# Altium schematic sheet GrandMini_v1.SchDoc
size A3; DocumentNumber: 1; SheetNumber: 1
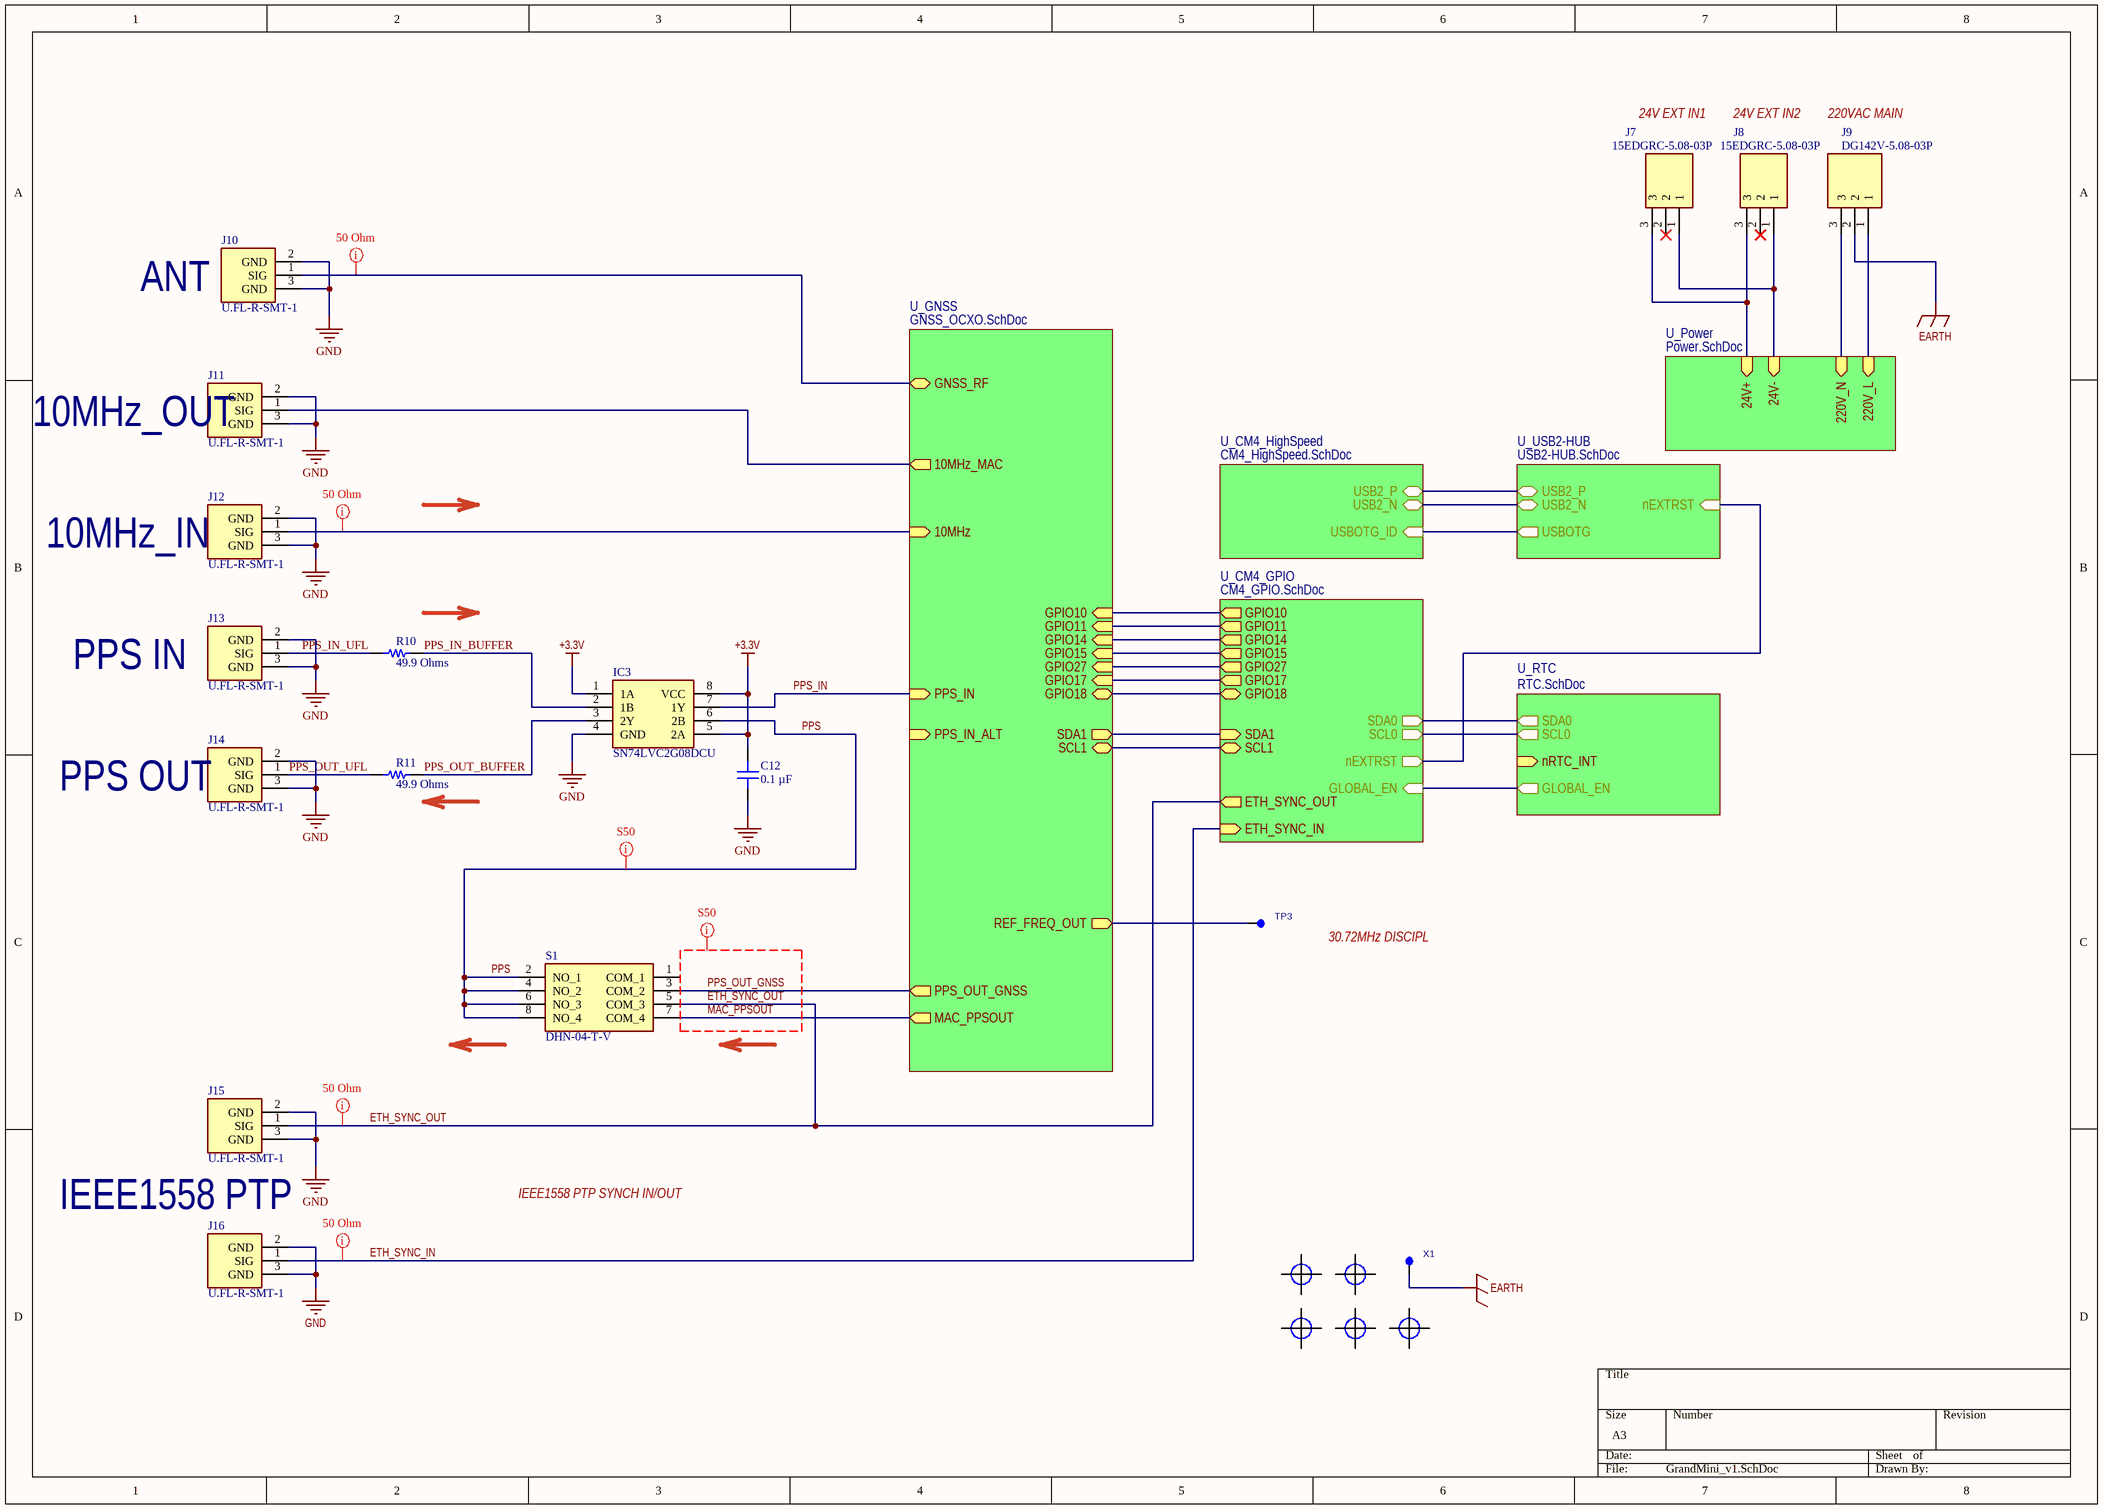
[diagram p0: GrandMini_v1.SchDoc]

## Parts
C12  0.1 µF  [CAP 0603_1608]
IC3  SN74LVC2G08DCU  [SOP50P310X90-8N]
J7  15EDGRC-5.08-03P  [15EDGRC-5.08-03P]
J8  15EDGRC-5.08-03P  [15EDGRC-5.08-03P]
J9  DG142V-5.08-03P  [DG142V-5.08-03P]
J10  U.FL-R-SMT-1  [U.FL-R-SMT-1]
J11  U.FL-R-SMT-1  [U.FL-R-SMT-1]
J12  U.FL-R-SMT-1  [U.FL-R-SMT-1]
J13  U.FL-R-SMT-1  [U.FL-R-SMT-1]
J14  U.FL-R-SMT-1  [U.FL-R-SMT-1]
J15  U.FL-R-SMT-1  [U.FL-R-SMT-1]
J16  U.FL-R-SMT-1  [U.FL-R-SMT-1]
MNT1  MOUNT_HOLE  [MOUNT_3.5mm]  (value not drawn)  (no BOM)
MNT2  MOUNT_HOLE  [MOUNT_3.5mm]  (value not drawn)  (no BOM)
MNT4  MOUNT_HOLE  [MOUNT_3.5mm]  (value not drawn)  (no BOM)
MNT5  MOUNT_HOLE  [MOUNT_3.5mm]  (value not drawn)  (no BOM)
MNT6  MOUNT_HOLE  [MOUNT_3.5mm]  (value not drawn)  (no BOM)
R10  49.9 Ohms  [YAGEO RES 0603_1608]
R11  49.9 Ohms  [YAGEO RES 0603_1608]
S1  DHN-04-T-V  [DHN04TV]
TP3  30.72MHz  [PAD_TEST]  (value not drawn)  (no BOM)
X1  PAD  [POWERPAD_ROU_7/3.2]  (value not drawn)  (no BOM)

## Sub-sheets
U_CM4_GPIO = CM4_GPIO.SchDoc: GLOBAL_EN (in), SCL0 (out), SDA0 (out), nEXTRST (out), SDA1 (in), SCL1 (bidir), ETH_SYNC_IN (in), ETH_SYNC_OUT (out), GPIO10 (out), GPIO11 (out), GPIO14 (out), GPIO15 (out), GPIO27 (out), GPIO17 (out), GPIO18 (bidir)
U_CM4_HighSpeed = CM4_HighSpeed.SchDoc: USBOTG_ID (in), USB2_P (bidir), USB2_N (bidir)
U_GNSS = GNSS_OCXO.SchDoc: 10MHz (in), GNSS_RF (bidir), PPS_IN_ALT (in), PPS_IN (in), GPIO17 (in), GPIO27 (in), GPIO11 (in), GPIO10 (in), REF_FREQ_OUT (out), PPS_OUT_GNSS (out), MAC_PPSOUT (out), GPIO15 (in), GPIO14 (in), GPIO18 (bidir), SDA1 (out), SCL1 (bidir), 10MHz_MAC (out)
U_Power = Power.SchDoc: 220V_L (in), 220V_N (in), 24V+ (in), 24V- (in)
U_RTC = RTC.SchDoc: SCL0 (out), SDA0 (out), GLOBAL_EN (out), nRTC_INT (in)
U_USB2-HUB = USB2-HUB.SchDoc: USB2_N (bidir), USBOTG (out), USB2_P (bidir), nEXTRST (in)

## Nets
+3.3V: C12.2 IC3.1(1A) IC3.5(2A) IC3.8(VCC)
EARTH: J9.2 X1.1
GND: C12.1 IC3.4(GND) J10.2(GND) J10.3(GND) J11.2(GND) J11.3(GND) J12.2(GND) J12.3(GND) J13.2(GND) J13.3(GND) J14.2(GND) J14.3(GND) J15.2(GND) J15.3(GND) J16.2(GND) J16.3(GND)
ETH_SYNC_IN: J16.1(SIG) ; sheet U_CM4_GPIO/ETH_SYNC_IN
ETH_SYNC_OUT: J15.1(SIG) S1.5(COM_3) ; sheet U_CM4_GPIO/ETH_SYNC_OUT
MAC_PPSOUT: S1.7(COM_4) ; sheet U_GNSS/MAC_PPSOUT
PPS: IC3.6(2B) S1.2(NO_1) S1.4(NO_2) S1.6(NO_3) S1.8(NO_4)
PPS_IN: IC3.7(1Y) ; sheet U_GNSS/PPS_IN
PPS_IN_BUFFER: IC3.2(1B) R10.2
PPS_IN_UFL: J13.1(SIG) R10.1
PPS_OUT_BUFFER: IC3.3(2Y) R11.2
PPS_OUT_GNSS: S1.3(COM_2) ; sheet U_GNSS/PPS_OUT_GNSS
PPS_OUT_UFL: J14.1(SIG) R11.1
NetJ7_1: J7.1 J8.1 ; sheet U_Power/24V-
NetJ7_3: J7.3 J8.3 ; sheet U_Power/24V+
NetJ9_1: J9.1 ; sheet U_Power/220V_L
NetJ9_3: J9.3 ; sheet U_Power/220V_N
NetJ10_1: J10.1(SIG) ; sheet U_GNSS/GNSS_RF
NetJ11_1: J11.1(SIG) ; sheet U_GNSS/10MHz_MAC
NetJ12_1: J12.1(SIG) ; sheet U_GNSS/10MHz
NetTP3_1: TP3.1 ; sheet U_GNSS/REF_FREQ_OUT
(unnamed): sheet U_CM4_GPIO/GLOBAL_EN, sheet U_RTC/GLOBAL_EN
(unnamed): sheet U_CM4_GPIO/SCL0, sheet U_RTC/SCL0
(unnamed): sheet U_CM4_GPIO/SDA0, sheet U_RTC/SDA0
(unnamed): sheet U_CM4_GPIO/nEXTRST, sheet U_USB2-HUB/nEXTRST
(unnamed): sheet U_CM4_GPIO/SDA1, sheet U_GNSS/SDA1
(unnamed): sheet U_CM4_GPIO/SCL1, sheet U_GNSS/SCL1
(unnamed): sheet U_CM4_GPIO/GPIO10, sheet U_GNSS/GPIO10
(unnamed): sheet U_CM4_GPIO/GPIO11, sheet U_GNSS/GPIO11
(unnamed): sheet U_CM4_GPIO/GPIO14, sheet U_GNSS/GPIO14
(unnamed): sheet U_CM4_GPIO/GPIO15, sheet U_GNSS/GPIO15
(unnamed): sheet U_CM4_GPIO/GPIO27, sheet U_GNSS/GPIO27
(unnamed): sheet U_CM4_GPIO/GPIO17, sheet U_GNSS/GPIO17
(unnamed): sheet U_CM4_GPIO/GPIO18, sheet U_GNSS/GPIO18
(unnamed): sheet U_CM4_HighSpeed/USBOTG_ID, sheet U_USB2-HUB/USBOTG
(unnamed): sheet U_CM4_HighSpeed/USB2_P, sheet U_USB2-HUB/USB2_P
(unnamed): sheet U_CM4_HighSpeed/USB2_N, sheet U_USB2-HUB/USB2_N

Not connected (* = marked no-connect by the designer): J7 2*; J8 2*; S1 1(COM_1)

## Layout directives
net class RF: ETH_SYNC_IN, ETH_SYNC_OUT, NetJ10_1, NetJ12_1
net class S50: ETH_SYNC_OUT, MAC_PPSOUT, PPS, PPS_OUT_GNSS

## Notes on the sheet
- 24V EXT IN1
- 24V EXT IN2
- 220VAC MAIN
- ANT
- (near J11) 10MHz_OUT
- (near J12) 10MHz_IN
- PPS IN
- (near J14) PPS OUT
- (near TP3) 30.72MHz DISCIPL
- IEEE1558 PTP SYNCH IN/OUT
- IEEE1558 PTP
- 1
- 2
- 3
- 4
- 5
- 6
- A
- B
- C
- www.raspberrypi.com <http://www.raspberrypi.com>
- D
- Title: Compute Module 4 IO Board - Top Level
- File: CM4IOv5.kicad_sch
- Sheet: /
- © 2020-2022 Raspberry Pi Ltd (formerly Raspberry Pi (Trading) Ltd.)
- KiCad E.D.A.  kicad (5.1.4)-1
- Size: A4
- Date:
- Rev: 1
- Id: 1/1

## Library data of the parts
C12 = CC0603KRX7R9BB104: CAP CER 0.1UF 50V X7R 0603; manufacturer: Yageo; Tolerance: ±10%; componentlink2url: https://www.digikey.com/en/products/detail/yageo/CC0603KRX7R9BB104/2103082; Value: 0.1 µF; componentlink2description: DigiKey Link; Temperature Coefficient: X7R; Capacitance: 0.1 µF; Part Number: CC0603KRX7R9BB104; Applications: General Purpose; componentlink1description: Datasheet; componentlink1url: https://www.yageo.com/upload/media/product/productsearch/datasheet/mlcc/UPY-GPHC_X7R_6.3V-to-50V_18.pdf; Device Package: 0603 (1608 Metric); lastupdated: 09.02.2024 20:10:21; Lifecycle Status: Active; Minimum Order: 1; Mounting Type: Surface Mount, MLCC; Operating Temperature: -55°C ~ 125°C; Package / Case: 0603 (1608 Metric); packaging: TapeAndReel; partid: 9506; Part Status: Active; price: 0.01; series: CC; Size / Dimension: 0.063" L x 0.031" W (1.60mm x 0.80mm); Supplier 1: DigiKey; Supplier Part Number 1: 311-1344-1-ND; Thickness (Max): 0.035" (0.90mm); Voltage - Rated: 50V
IC3 = SN74LVC2G08DCU: Integrated Circuit; Manufacturer_Name: Texas Instruments; Datasheet Link: https://datasheet.datasheetarchive.com/originals/distributors/Datasheets-SFU2/DSASFU100028333.pdf; Height: 0.9mm; Manufacturer_Part_Number: SN74LVC2G08DCU
J7 J8 = 15EDGRC-5.08-03P: Connector; Manufacturer_Name: Degson; Manufacturer_Part_Number: 15EDGRC-5.08-02P-14-00A(H); Height: 7.24mm
J9 = DG142V-5.08-03P_1: Connector; pin to pad: 1>1+4 2>2+5 3>3+6; Manufacturer_Name: Degson; Manufacturer_Part_Number: DG142V-5.08-02P; Datasheet Link: https://oss.degson.com/upload/pdf/20211003/20211003190604_7549.pdf; Height: 14.1mm
J10-J16 = U.FL-R-SMT-1: Connector; Manufacturer_Name: Hirose; Height: 1.5; Manufacturer_Part_Number: U.FL-R-SMT-1
MNT1 MNT2 MNT4-MNT6 = MOUNT_HOLE: Mount hole
R10 R11 = RC0603FR-0749R9L: RES 49.9 OHM 1% 1/10W 0603; Manufacturer: Yageo; Power (Watts): 0.1W, 1/10W; Temperature Coefficient: ±100ppm/°C; Packaging: CutTape; ComponentLink2Description: DigiKey Link; ComponentLink1Description: Datasheet; ComponentLink2URL: https://www.digikey.com/en/products/detail/yageo/RC0603FR-0749R9L/727264; ComponentLink1URL: https://www.yageo.com/upload/media/product/productsearch/datasheet/rchip/PYu-RC_Group_51_RoHS_L_10.pdf; Part Number: RC0603FR-0749R9L; Value: 49.9 Ohms; Composition: Thick Film; Device Package: 0603 (1608 Metric); Features: Moisture Resistant; Height - Seated (Max): 0.022" (0.55mm); LastUpdated: 25.07.2024 9:19:17; Lifecycle Status: Active; Minimum Order: 1; Number of Terminations: 2; Operating Temperature: -55°C ~ 155°C; Package / Case: 0603 (1608 Metric); PartId: 23951; Part Status: Active; Price: 0.01; Resistance: 49.9 Ohms; Series: RC_L; Size / Dimension: 0.063" L x 0.031" W (1.60mm x 0.80mm); Supplier 1: DigiKey; Supplier Part Number 1: 311-49.9HRCT-ND; Supplier Device Package: 0603; Tolerance: ±1%
S1 = DHN-04-T-V: Switch; Manufacturer_Name: Diptronics; Datasheet Link: https://componentsearchengine.com/Datasheets/1/DHN-04-T-V.pdf; Height: 1.65mm; Manufacturer_Part_Number: DHN-04-T-V; Mouser Part Number: 113-DHN04TV; Mouser Price/Stock: https://www.mouser.co.uk/ProductDetail/Diptronics/DHN-04-T-V?qs=MLItCLRbWswbt%252B1%2FkyC9JQ%3D%3D
TP3 = PAD_TEST: Test Point; Manufacturer: {Manufacturer}; Reseller3: {Reseller3}; Reseller1: {Reseller1}; Tempcoeff: {Tempcoeff}; Reseller2: {Reseller2}; Tolerance: {Tolerance}; Value: .NetName; PowerVoltage: {PowerVoltage}; CatalogueCode: {CatalogueCode}; Case: {Case}
X1 = PAD: Power Pad; Manufacturer: {Manufacturer}; Reseller3: {Reseller3}; Reseller1: {Reseller1}; Tempcoeff: {Tempcoeff}; Reseller2: {Reseller2}; Tolerance: {Tolerance}; Value: {Value}; PowerVoltage: {PowerVoltage}; CatalogueCode: {CatalogueCode}; Case: {Case}